# Altium schematic sheet GPIO.SchDoc
size A4
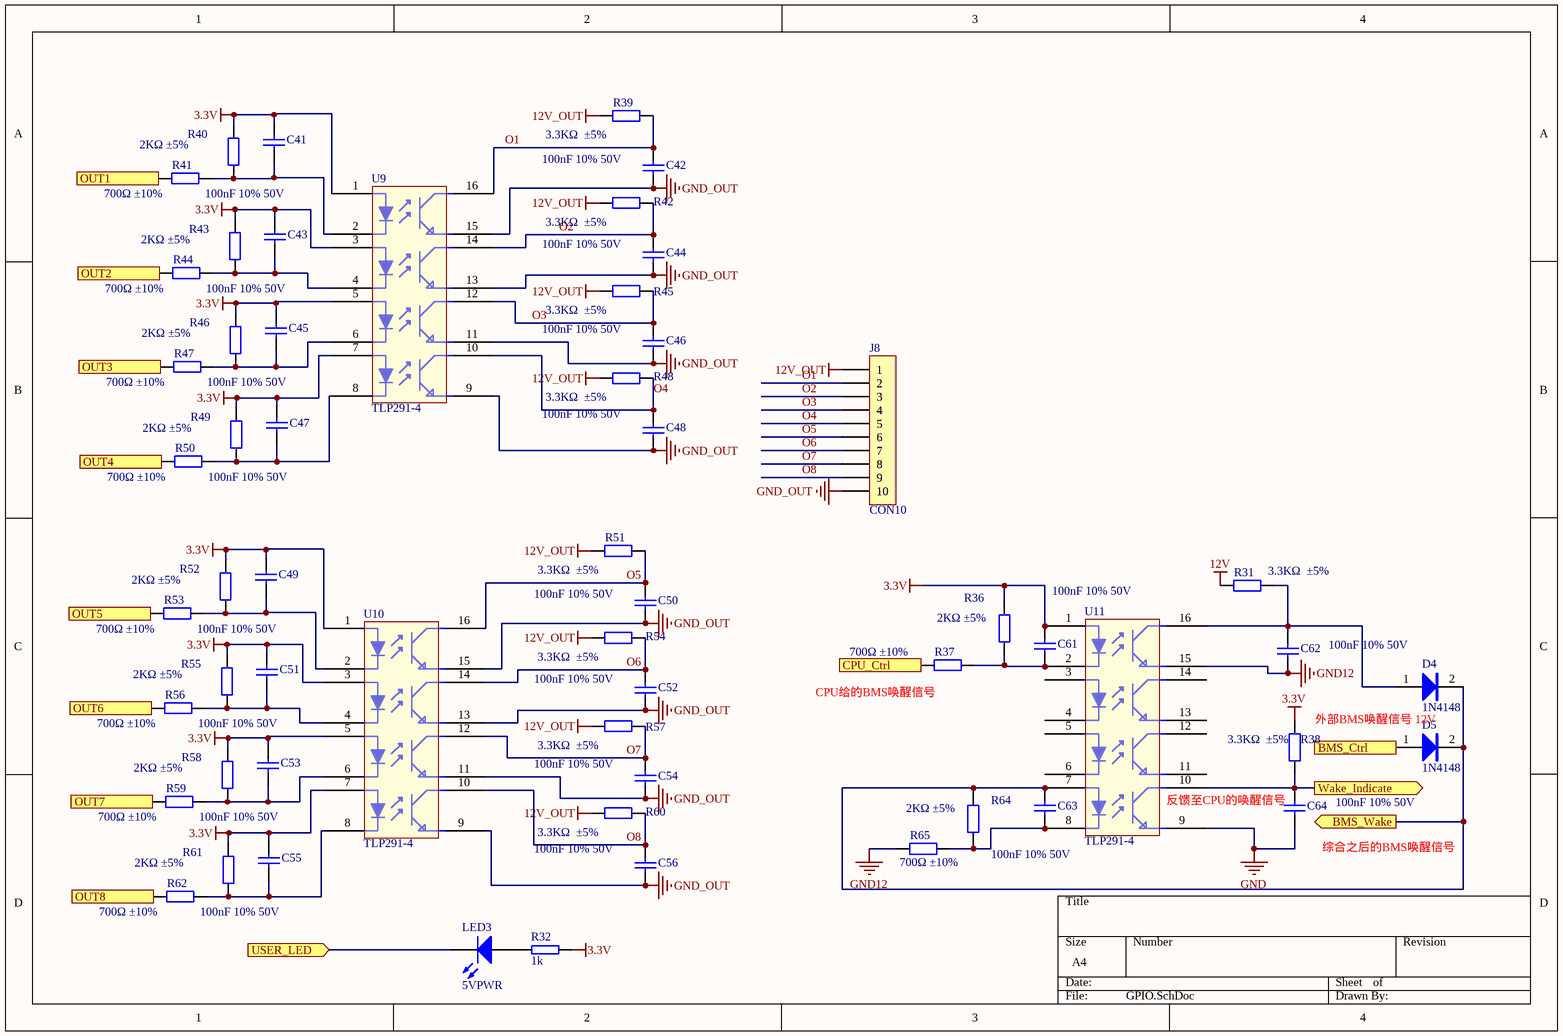
[diagram p0: GPIO.SchDoc]

## Parts
C41  100nF 10% 50V  [0603_C]
C42  100nF 10% 50V  [0603_C]
C43  100nF 10% 50V  [0603_C]
C44  100nF 10% 50V  [0603_C]
C45  100nF 10% 50V  [0603_C]
C46  100nF 10% 50V  [0603_C]
C47  100nF 10% 50V  [0603_C]
C48  100nF 10% 50V  [0603_C]
C49  100nF 10% 50V  [0603_C]
C50  100nF 10% 50V  [0603_C]
C51  100nF 10% 50V  [0603_C]
C52  100nF 10% 50V  [0603_C]
C53  100nF 10% 50V  [0603_C]
C54  100nF 10% 50V  [0603_C]
C55  100nF 10% 50V  [0603_C]
C56  100nF 10% 50V  [0603_C]
C61  100nF 10% 50V  [0603_C]
C62  100nF 10% 50V  [0603_C]
C63  100nF 10% 50V  [0603_C]
C64  100nF 10% 50V  [0603_C]
D4  1N4148  [SOD-323]
D5  1N4148  [SOD-323]
J8  CON10  [XH2.54-SMD-5*2P]
LED3  5VPWR  [LED]
R31  3.3KΩ  ±5%  [0603_R]
R32  1k  [0603_R]
R36  2KΩ ±5%  [0603_R]
R37  700Ω ±10%  [0603_R]
R38  3.3KΩ  ±5%  [0603_R]
R39  3.3KΩ  ±5%  [0603_R]
R40  2KΩ ±5%  [0603_R]
R41  700Ω ±10%  [0603_R]
R42  3.3KΩ  ±5%  [0603_R]
R43  2KΩ ±5%  [0603_R]
R44  700Ω ±10%  [0603_R]
R45  3.3KΩ  ±5%  [0603_R]
R46  2KΩ ±5%  [0603_R]
R47  700Ω ±10%  [0603_R]
R48  3.3KΩ  ±5%  [0603_R]
R49  2KΩ ±5%  [0603_R]
R50  700Ω ±10%  [0603_R]
R51  3.3KΩ  ±5%  [0603_R]
R52  2KΩ ±5%  [0603_R]
R53  700Ω ±10%  [0603_R]
R54  3.3KΩ  ±5%  [0603_R]
R55  2KΩ ±5%  [0603_R]
R56  700Ω ±10%  [0603_R]
R57  3.3KΩ  ±5%  [0603_R]
R58  2KΩ ±5%  [0603_R]
R59  700Ω ±10%  [0603_R]
R60  3.3KΩ  ±5%  [0603_R]
R61  2KΩ ±5%  [0603_R]
R62  700Ω ±10%  [0603_R]
R64  2KΩ ±5%  [0603_R]
R65  700Ω ±10%  [0603_R]
U9  TLP291-4  [SOP16_M]
U10  TLP291-4  [SOP16_M]
U11  TLP291-4  [SOP16_M]

## Ports
BMS_Ctrl (in), BMS_Wake (out), CPU_Ctrl (in), OUT1 (in), OUT2 (in), OUT3 (in), OUT4 (in), OUT5 (in), OUT6 (in), OUT7 (in), OUT8 (in), USER_LED (in), Wake_Indicate (out)

## Nets
3.3V: C41.2 C43.2 C45.2 C47.2 C49.2 C51.2 C53.2 C55.2 C61.2 R32.1 R36.2 R38.1 R40.2 R43.2 R46.2 R49.2 R52.2 R55.2 R58.2 R61.2 U9.1(INPUT-A) U9.3(EMITTER) U9.5 U9.7 U10.1(INPUT-A) U10.3(EMITTER) U10.5 U10.7 U11.1(INPUT-A)
12V: R31.2
12V_OUT: J8.1 R39.2 R42.2 R45.2 R48.2 R51.2 R54.2 R57.2 R60.2
GND: C64.1 U11.9
GND12: C62.1 R65.1 U11.15
GND_OUT: C42.1 C44.1 C46.1 C48.1 C50.1 C52.1 C54.1 C56.1 J8.10 U9.9 U9.11 U9.13 U9.15 U10.9 U10.11 U10.13 U10.15
BMS_Ctrl: D5.1 ; port BMS_Ctrl
BMS_Wake: C63.2 D4.2 D5.2 R64.2 U11.7 ; port BMS_Wake
CPU_Ctrl: R37.1 ; port CPU_Ctrl
O1: C42.2 J8.2 R39.1 U9.16
O2: C44.2 J8.3 R42.1 U9.14
O3: C46.2 J8.4 R45.1 U9.12
O4: C48.2 J8.5 R48.1 U9.10
O5: C50.2 J8.6 R51.1 U10.16
O6: C52.2 J8.7 R54.1 U10.14
O7: C54.2 J8.8 R57.1 U10.12
O8: C56.2 J8.9 R60.1 U10.10
OUT1: R41.1 ; port OUT1
OUT2: R44.1 ; port OUT2
OUT3: R47.1 ; port OUT3
OUT4: R50.1 ; port OUT4
OUT5: R53.1 ; port OUT5
OUT6: R56.1 ; port OUT6
OUT7: R59.1 ; port OUT7
OUT8: R62.1 ; port OUT8
USER_LED: LED3.2(K) ; port USER_LED
Wake_Indicate: C64.2 R38.2 U11.10 ; port Wake_Indicate
NetC41_1: C41.1 R40.1 R41.2 U9.2(INPUT-K)
NetC43_1: C43.1 R43.1 R44.2 U9.4(COLLECTOR)
NetC45_1: C45.1 R46.1 R47.2 U9.6
NetC47_1: C47.1 R49.1 R50.2 U9.8
NetC49_1: C49.1 R52.1 R53.2 U10.2(INPUT-K)
NetC51_1: C51.1 R55.1 R56.2 U10.4(COLLECTOR)
NetC53_1: C53.1 R58.1 R59.2 U10.6
NetC55_1: C55.1 R61.1 R62.2 U10.8
NetC61_1: C61.1 R36.1 R37.2 U11.2(INPUT-K)
NetC62_2: C62.2 D4.1 R31.1 U11.16
NetC63_1: C63.1 R64.1 R65.2 U11.8
NetLED3_1: LED3.1(A) R32.2

Not connected (* = marked no-connect by the designer): U11 3(EMITTER) 4(COLLECTOR) 5 6 11 12 13 14

## Notes on the sheet
- (near R37) CPU给的BMS唤醒信号
- 外部BMS唤醒信号 12V
- (near U11) 反馈至CPU的唤醒信号
- (near C64) 综合之后的BMS唤醒信号

## Library data of the parts
C41-C56 C61-C64 = 0603 1nF (102) 10% 50V: 贴片电容; ComponentLink1Description: 供应商链接; ComponentLink1URL: http://www.szlcsc.com/product/details_1940.html; Package: 0603; Supplier: LC; SuppliersPartNumber: C1588
D4 D5 = SS34
LED3 = LED2: Typical RED, GREEN, YELLOW, AMBER GaAs LED; Published: 8-Jun-2000; LatestRevisionDate: 17-Jul-2002; LatestRevisionNote: Re-released for DXP Platform.; PackageDocument: Feb-2002; PackageReference: 3.2X1.6X1.1; Publisher: Altium Limited
R31 R38 R39 R42 R45 R48 R51 R54 R57 R60 = 0603 3.3KΩ (3301) 1%: 贴片电阻; ComponentLink1Description: 供应商链接; ComponentLink1URL: http://www.szlcsc.com/product/details_23705.html; Package: 0603; Supplier: LC; SuppliersPartNumber: C22978
R32 = RES
R36 R40 R43 R46 R49 R52 R55 R58 R61 R64 = 0603 2KΩ (2001) 1%: 贴片电阻; ComponentLink1Description: 供应商链接; ComponentLink1URL: http://www.szlcsc.com/product/details_23702.html; Package: 0603; Supplier: LC; SuppliersPartNumber: C22975
R37 R41 R44 R47 R50 R53 R56 R59 R62 R65 = 0603 5.6KΩ (5601) 1%: 贴片电阻; ComponentLink1Description: 供应商链接; ComponentLink1URL: http://www.szlcsc.com/product/details_23916.html; Package: 0603; Supplier: LC; SuppliersPartNumber: C23189
U9-U11 = PS2801: 东芝四通道光耦 SOP16